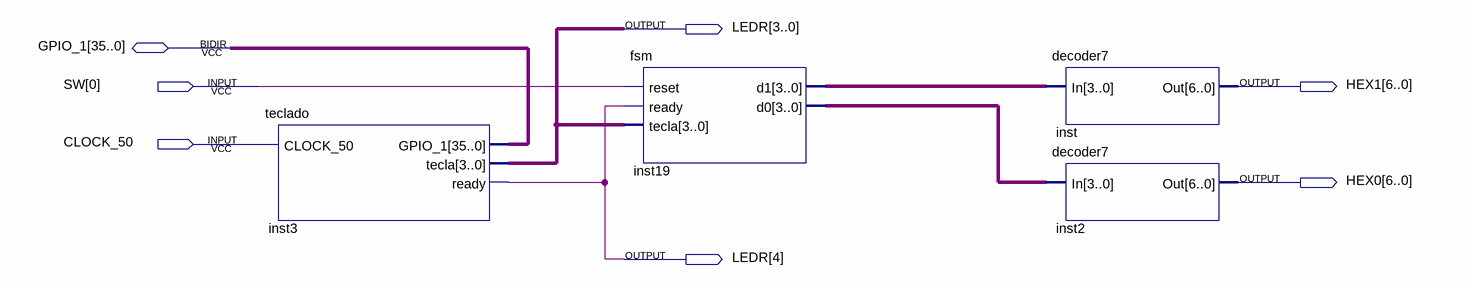
[diagram p0: schematic sheet]
// Quartus schematic top.bdf as structural Verilog: 4 symbols, 7 pins
module top (
  input  [0:0] SW,
  input  CLOCK_50,
  inout  [35:0] GPIO_1,
  output [4:0] LEDR,
  output [6:0] HEX1,
  output [6:0] HEX0
);

  wire [3:0] inst19_d0, inst19_d1;

  teclado inst3 (.CLOCK_50(CLOCK_50), .tecla(LEDR[3:0]), .ready(LEDR[4]), .GPIO_1(GPIO_1));
  fsm inst19 (.reset(SW[0]), .ready(LEDR[4]), .tecla(LEDR[3:0]), .d1(inst19_d1), .d0(inst19_d0));
  decoder7 inst (.In(inst19_d1), .Out(HEX1));
  decoder7 inst2 (.In(inst19_d0), .Out(HEX0));
endmodule
